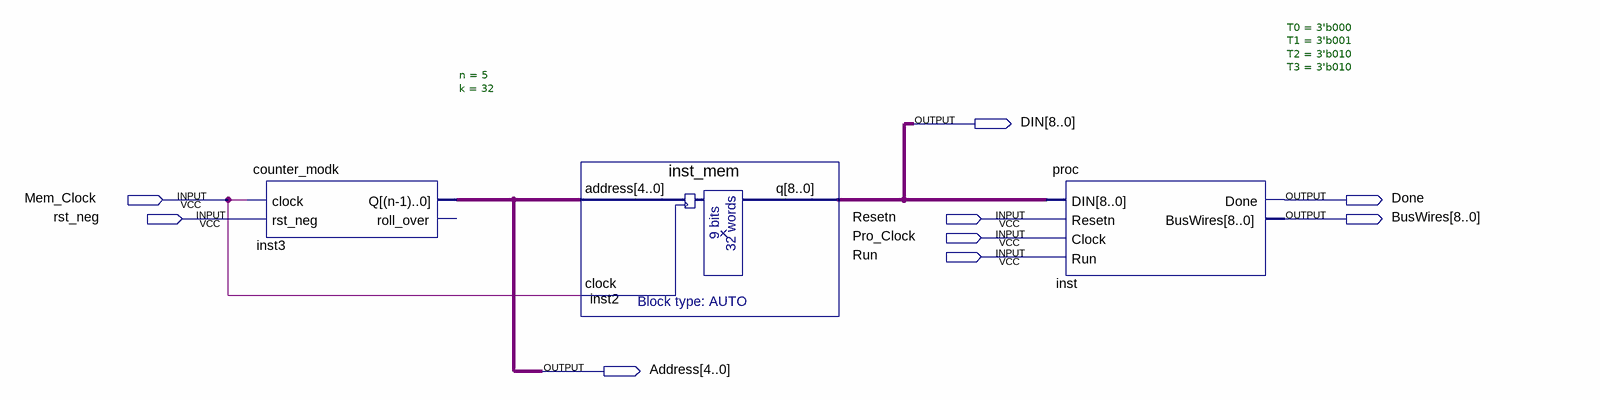
[diagram p0: schematic sheet]
// Quartus schematic Lab9Part2.bdf as structural Verilog: 3 symbols, 9 pins
module Lab9Part2 (
  input  Mem_Clock,
  input  rst_neg,
  input  Resetn,
  input  Pro_Clock,
  input  Run,
  output [8:0] DIN,
  output Done,
  output [8:0] BusWires,
  output [4:0] Address
);

  counter_modk #(.n(5), .k(32)) inst3 (.clock(Mem_Clock), .rst_neg(rst_neg), .Q(Address));  // open: roll_over
  inst_mem inst2 (.address(Address), .clock(Mem_Clock), .q(DIN));
  proc #(.T0(3'b000), .T1(3'b001), .T2(3'b010), .T3(3'b010)) inst (
    .DIN(DIN), .Resetn(Resetn), .Clock(Pro_Clock), .Run(Run), .Done(Done), .BusWires(BusWires));
endmodule
